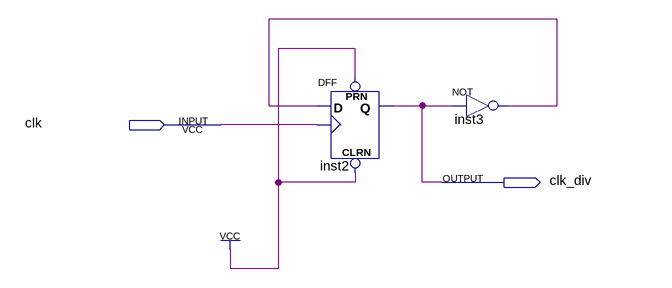
[diagram p0: schematic sheet]
// Quartus schematic clk_divider.bdf as structural Verilog: 2 symbols, 2 pins
module clk_divider (
  input  clk,
  output clk_div
);

  wire inst3_out;

  DFF inst2 (.CLRN(1'b1), .CLK(clk), .D(inst3_out), .PRN(1'b1), .Q(clk_div));
  not inst3 (inst3_out, clk_div);
endmodule
